# EAGLE design boba_fett_chest (EAGLE 7.0.0)
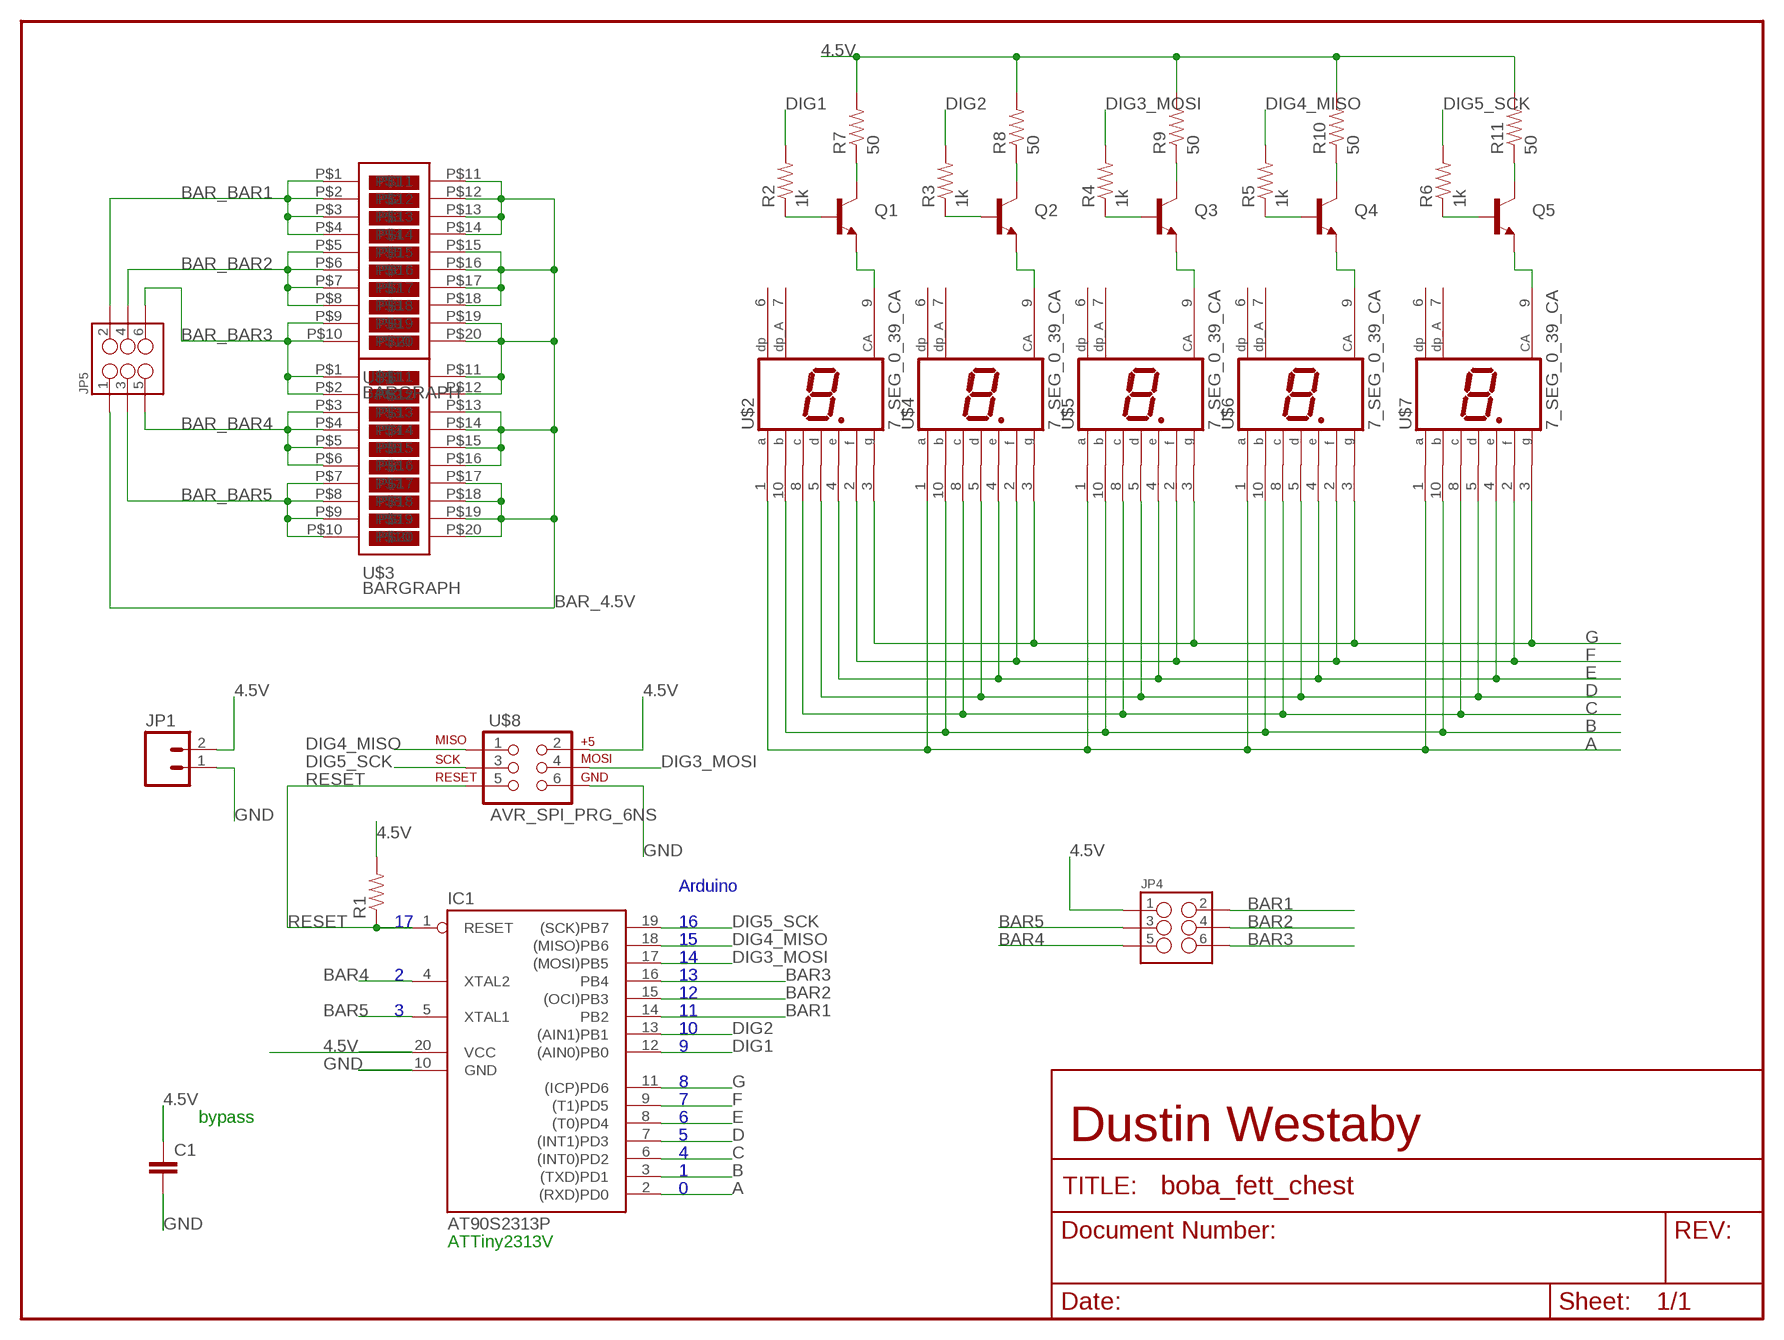
[diagram p0: schematic, sheet 1]

## Parts
C1  CAPCAP-PTH-2MM  [CAP-PTH-2MM]
IC1  AT90S2313P  [DIL20]
JP1  M02PTH  [1X02]
JP4  M03X22X3_SILK_SM  [2X3]
JP5  M03X22X3_SILK_SM  [2X3]
Q1  TRANSISTOR_NPNTO92  [TO-92]
Q2  TRANSISTOR_NPNTO92  [TO-92]
Q3  TRANSISTOR_NPNTO92  [TO-92]
Q4  TRANSISTOR_NPNTO92  [TO-92]
Q5  TRANSISTOR_NPNTO92  [TO-92]
R1  RESISTORPTH1  [AXIAL-0.3]
R2  1k  RESISTORPTH1  [AXIAL-0.3]
R3  1k  RESISTORPTH1  [AXIAL-0.3]
R4  1k  RESISTORPTH1  [AXIAL-0.3]
R5  1k  RESISTORPTH1  [AXIAL-0.3]
R6  1k  RESISTORPTH1  [AXIAL-0.3]
R7  50  RESISTORPTH1  [AXIAL-0.3]
R8  50  RESISTORPTH1  [AXIAL-0.3]
R9  50  RESISTORPTH1  [AXIAL-0.3]
R10  50  RESISTORPTH1  [AXIAL-0.3]
R11  50  RESISTORPTH1  [AXIAL-0.3]
U$1  BARGRAPH  [BARGRAPH]
U$2  7_SEG_0_39_CA  [0_39_DISP]
U$3  BARGRAPH  [BARGRAPH]
U$4  7_SEG_0_39_CA  [0_39_DISP]
U$5  7_SEG_0_39_CA  [0_39_DISP]
U$6  7_SEG_0_39_CA  [0_39_DISP]
U$7  7_SEG_0_39_CA  [0_39_DISP]
U$8  AVR_SPI_PRG_6NS  [2X3-NS]

## Nets
4.5V: C1.1 IC1.20(VCC) JP1.2 JP4.1 R1.P$2 R7.P$2 R8.P$2 R9.P$2 R10.P$2 R11.P$2 U$8.2
A: IC1.2((RXD)PD0) U$2.1(A) U$4.1(A) U$5.1(A) U$6.1(A) U$7.1(A)
B: IC1.3((TXD)PD1) U$2.10(B) U$4.10(B) U$5.10(B) U$6.10(B) U$7.10(B)
BAR1: IC1.14(PB2) JP4.2
BAR2: IC1.15((OCI)PB3) JP4.4
BAR3: IC1.16(PB4) JP4.6
BAR4: IC1.4(XTAL2) JP4.5
BAR5: IC1.5(XTAL1) JP4.3
BAR_4.5V: JP5.1 U$1.P$11 U$1.P$12 U$1.P$13 U$1.P$14 U$1.P$15 U$1.P$16 U$1.P$17 U$1.P$18 U$1.P$19 U$1.P$20 U$3.P$11 U$3.P$12 U$3.P$13 U$3.P$14 U$3.P$15 U$3.P$16 U$3.P$17 U$3.P$18 U$3.P$19 U$3.P$20
BAR_BAR1: JP5.2 U$1.P$1 U$1.P$2 U$1.P$3 U$1.P$4
BAR_BAR2: JP5.4 U$1.P$5 U$1.P$6 U$1.P$7 U$1.P$8
BAR_BAR3: JP5.6 U$1.P$9 U$1.P$10 U$3.P$1 U$3.P$2
BAR_BAR4: JP5.5 U$3.P$3 U$3.P$4 U$3.P$5 U$3.P$6
BAR_BAR5: JP5.3 U$3.P$7 U$3.P$8 U$3.P$9 U$3.P$10
C: IC1.6((INT0)PD2) U$2.8(C) U$4.8(C) U$5.8(C) U$6.8(C) U$7.8(C)
D: IC1.7((INT1)PD3) U$2.5(D) U$4.5(D) U$5.5(D) U$6.5(D) U$7.5(D)
DIG1: IC1.12((AIN0)PB0) R2.P$2
DIG2: IC1.13((AIN1)PB1) R3.P$2
DIG3_MOSI: IC1.17((MOSI)PB5) R4.P$2 U$8.4
DIG4_MISO: IC1.18((MISO)PB6) R5.P$2 U$8.1
DIG5_SCK: IC1.19((SCK)PB7) R6.P$2 U$8.3
E: IC1.8((T0)PD4) U$2.4(E) U$4.4(E) U$5.4(E) U$6.4(E) U$7.4(E)
F: IC1.9((T1)PD5) U$2.2(F) U$4.2(F) U$5.2(F) U$6.2(F) U$7.2(F)
G: IC1.11((ICP)PD6) U$2.3(G) U$4.3(G) U$5.3(G) U$6.3(G) U$7.3(G)
GND: C1.2 IC1.10(GND) JP1.1 U$8.6
N$1: Q5.1(E) U$7.9(CA)
N$2: Q4.1(E) U$6.9(CA)
N$3: Q3.1(E) U$5.9(CA)
N$4: Q2.1(E) U$4.9(CA)
N$5: Q1.1(E) U$2.9(CA)
N$6: Q1.2(B) R2.P$1
N$7: Q2.2(B) R3.P$1
N$8: Q3.2(B) R4.P$1
N$9: Q4.2(B) R5.P$1
N$10: Q5.2(B) R6.P$1
N$16: Q1.3(C) R7.P$1
N$17: Q2.3(C) R8.P$1
N$18: Q3.3(C) R9.P$1
N$19: Q4.3(C) R10.P$1
N$20: Q5.3(C) R11.P$1
RESET: IC1.1(RESET) R1.P$1 U$8.5
Unconnected: U$2.6(DP) U$2.7(CA) U$4.6(DP) U$4.7(CA) U$5.6(DP) U$5.7(CA) U$6.6(DP) U$6.7(CA) U$7.6(DP) U$7.7(CA)

## Notes on the sheet
- Arduino
- 17 | 16
- 15
- 14
- 2 | 13
- 12
- 3 | 11
- 10
- 9
- 8
- 7
- bypass | 6
- 5 | Dustin Westaby
- 4
- 1
- 0
- ATTiny2313V

## Library data of the parts
C1 = SparkFun:CAP: Capacitor Standard 0603 ceramic capacitor, and 0.1" leaded capacitor.
IC1 = avr-5:AT90S2313: MICROCONTROLLER 2 Kbytes FLASH 128 bytes SRAM 128 bytes EEPROM UART
JP1 = SparkFun:M02: Header 2 Standard 2-pin 0.1" header. Use with straight break away headers (SKU : PRT-00116), right angle break away headers (PRT-00553), swiss pins (PRT-00743), machine pins (PRT-00117), and female headers (PRT-00115). Molex polarized connector foot print use with SKU : PRT-08233 with associated crimp pins and housings.
JP4 JP5 = SparkFun-Connectors:M03X2: 2x3 .1" header. Shrouded, with keying- CONN-10681 SMT- CONN-11415 Pogo pins- HW-11044
Q1-Q5 = SparkFun:TRANSISTOR_NPN: Transistor NPN BJT configuration in SOT23 package. MMBT2222 is the common NPN we use. Double check BCE configuration again layout.
R1-R11 = SparkFun:RESISTOR: Resistor Basic schematic elements and footprints for 0603, 1206, and PTH 1/10th watt (small) resistors.
U$1 U$3 = boba_display:BARGRAPH
U$2 U$4-U$7 = boba_display_4:7_SEG_0_39_CA
U$8 = SparkFun:AVR_SPI_PRG_6: AVR ISP 6 Pin This is the reduced ISP connector for AVR programming. Common on Arduino. This footprint will take up less PCB space and can be used with a 10-pin to 6-pin adapter such as SKU: BOB-08508

## Board
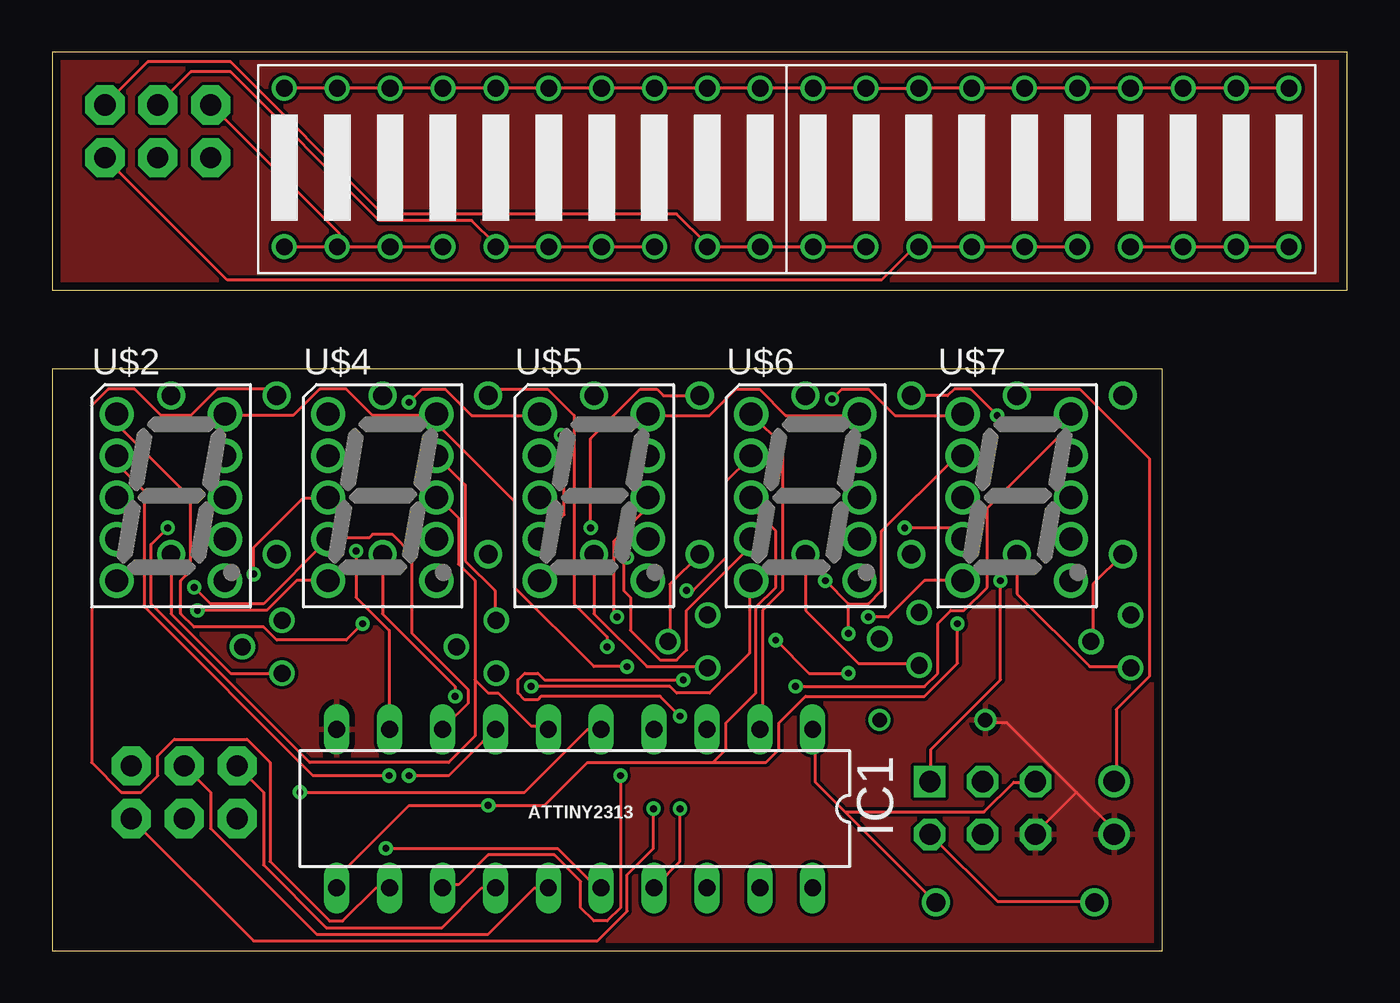
[diagram p1: board, top side]
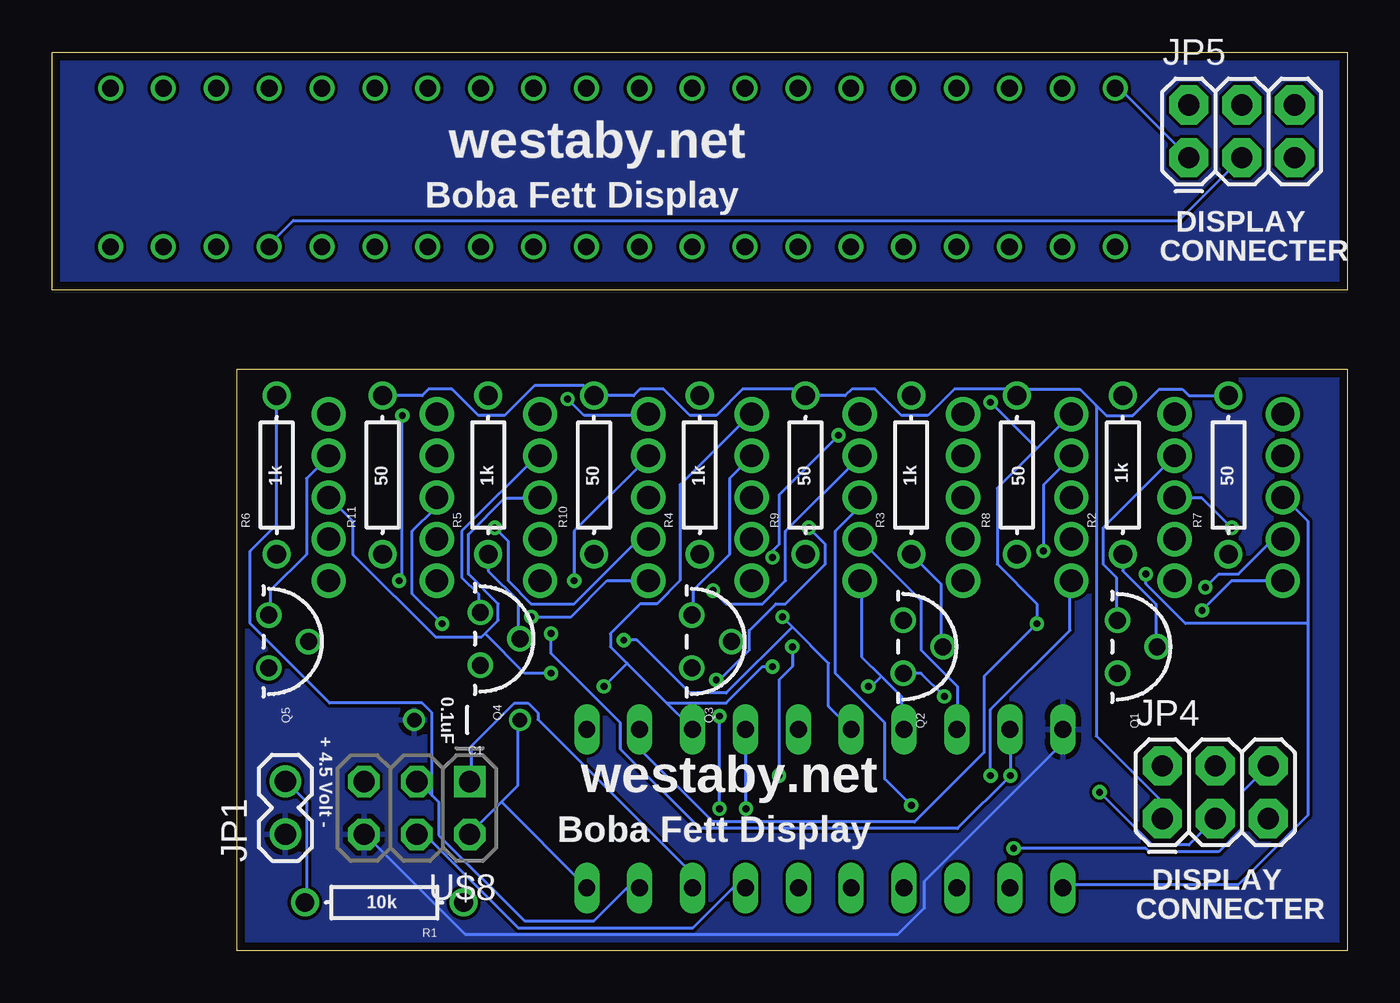
[diagram p2: board, bottom side, seen from below]

Size 62.23 x 43.18 mm. Coordinates in mm from the lower left corner, seen from the top.
Outline: 0,0 53.34,0 53.34,27.94 0,27.94 0,0
Outline: 0,31.75 62.23,31.75 62.23,43.18 0,43.18 0,31.75
Copper layers (1*16): Top 0.0356mm / dielectric 1.5011mm / Bottom 0.0356mm
Design rules "OSHpark-2layer": minimum track width 6mil, minimum drill 13mil, track to track 6mil, track to pad 6mil, pad to pad 6mil, via to via 6mil, smd to smd 6mil, copper to edge 15mil, drill to drill 6mil, minimum pad ring 7mil, minimum via ring 7mil, stop-mask expansion 3mil, vias tented up to drill 0mil, thermal gap 10mil

### Footprints (pad centres in the part's own frame; a part is rotated, then mirrored left to right if it is on the bottom)
CAP-PTH-2MM = drill 0.7: 1 -2.54,0; 2 2.54,0
DIL20 = drill 0.813 long: 1 -11.43,-3.81; 2 -8.89,-3.81; 3 -6.35,-3.81; 4 -3.81,-3.81; 5 -1.27,-3.81; 6 1.27,-3.81; 7 3.81,-3.81; 8 6.35,-3.81; 9 8.89,-3.81; 10 11.43,-3.81; 11 11.43,3.81; 12 8.89,3.81; 13 6.35,3.81; 14 3.81,3.81; 15 1.27,3.81; 16 -1.27,3.81; 17 -3.81,3.81; 18 -6.35,3.81; 19 -8.89,3.81; 20 -11.43,3.81
1X02 = drill 1.016: 1 0,0; 2 2.54,0
2X3 = drill 1.016 pad 1.88 octagon: 1 0,0; 2 0,2.54; 3 2.54,0; 4 2.54,2.54; 5 5.08,0; 6 5.08,2.54
TO-92 = drill 0.813: 1 -1.27,0; 2 0,1.905; 3 1.27,0
AXIAL-0.3 = drill 0.9: P$1 -3.81,0; P$2 3.81,0
BARGRAPH = drill 0.8: P$1 1.27,1.27; P$2 3.81,1.27; P$3 6.35,1.27; P$4 8.89,1.27; P$5 11.43,1.27; P$6 13.97,1.27; P$7 16.51,1.27; P$8 19.05,1.27; P$9 21.59,1.27; P$10 24.13,1.27; P$11 1.27,8.89; P$12 3.81,8.89; P$13 6.35,8.89; P$14 8.89,8.89; P$15 11.43,8.89; P$16 13.97,8.89; P$17 16.51,8.89; P$18 19.05,8.89; P$19 21.59,8.89; P$20 24.13,8.89
0_39_DISP = drill 1.1: 1 -0.07,8; 2 -0.07,6; 3 -0.07,4; 4 -0.07,2; 5 -0.07,0; 6 5.13,0; 7 5.13,2; 8 5.13,4; 9 5.13,6; 10 5.13,8
2X3-NS = drill 1.016 square: 1 -2.54,-1.27 | drill 1.016 octagon: 2 -2.54,1.27; 3 0,-1.27; 4 0,1.27; 5 2.54,-1.27; 6 2.54,1.27

### Placement (x,y rotation side)
C1  42.29,11.08 180 bottom
IC1  25.11,6.83 180 top
JP1  51.02,5.6 90 bottom
JP4  8.89,6.35 0 bottom
JP5  7.62,38.1 0 bottom
Q1  11.05,14.61 270 bottom
Q2  21.34,14.61 270 bottom
Q3  31.5,14.86 270 bottom
Q4  41.66,14.99 270 bottom
Q5  51.82,14.86 270 bottom
R1  46.27,2.32 180 bottom
R2  10.79,22.86 90 bottom
R3  20.95,22.86 90 bottom
R4  31.11,22.86 90 bottom
R5  41.27,22.86 90 bottom
R6  51.44,22.86 90 bottom
R7  5.71,22.86 90 bottom
R8  15.88,22.86 90 bottom
R9  26.04,22.86 90 bottom
R10  36.2,22.86 90 bottom
R11  46.35,22.86 90 bottom
U$1  9.89,32.55 0 top
U$2  3.17,17.78 0 top
U$3  35.29,32.55 0 top
U$4  13.34,17.78 0 top
U$5  23.5,17.78 0 top
U$6  33.66,17.78 0 top
U$7  43.81,17.78 0 top
U$8  44.7,6.86 180 bottom

### Tracks (layer width: path | path; a pad name or v marks a point on that pad's centre or on a via)
4.5V
  Top 0.152: R1.P$2 50.01,2.38 45.4,2.38 42.23,5.56 U$8.2 | R11.P$2 46.67,26.99 49.37,26.99 52.7,23.65 52.7,13.18 51.12,11.59 51.12,8.26 JP1.2
  Bottom 0.152: R1.P$2 50.01,2.38 50.01,7.14 50.96,8.1 JP1.2 | 40.64,7.14 42.07,5.71 U$8.2 | 40.64,7.14 39.85,7.94 39.85,10.95 C1.1 | 40.64,7.14 36.67,3.17 IC1.20 | R7.P$2 7.62,26.67 7.94,26.99 9.05,26.99 10.32,25.72 11.59,25.72 12.06,26.19 | 12.06,26.19 12.86,26.99 15.56,26.99 | 15.56,26.99 18.89,26.99 20.16,25.72 21.43,25.72 22.7,26.99 23.81,26.99 24.13,26.67 R9.P$2 26.35,26.99 29.05,26.99 30.32,25.72 31.59,25.72 32.86,26.99 33.97,26.99 34.29,26.67 R10.P$2 36.67,27.15 39.05,27.15 40.48,25.72 41.75,25.72 43.02,26.99 44.13,26.99 44.45,26.67 R11.P$2 | 15.56,26.99 R8.P$2 | JP4.1 8.89,7.14 12.06,10.32 12.06,26.19
A  (via drill 0.33)
  Top 0.152: IC1.2 34.13,10.79 34.13,16.35 35.08,17.3 35.08,24.29 33.66,25.72 U$6.1 | v37.47,26.51 37.94,26.99 39.21,26.99 40.48,25.72 43.66,25.72 U$7.1 | v14.92,15.72 14.13,14.92 10.79,14.92 10.16,15.56 6.83,15.56 6.19,16.19 6.19,17.78 6.67,18.26 6.67,21.75 3.17,25.24 3.17,25.72 U$2.1 | v17.14,26.35 17.78,26.99 18.89,26.99 20.16,25.72 23.34,25.72 U$5.1
  Bottom 0.152: v37.47,26.51 36.67,25.72 33.66,25.72 U$6.1 | 14.92,24.13 13.34,25.72 U$4.1 | 14.92,24.13 16.83,22.23 16.83,18.57 14.92,16.67 v14.92,15.72 17.46,13.18 17.46,9.53 20.8,6.19 30.48,6.19 33.97,9.68 33.97,10.64 IC1.2 | 14.92,24.13 v17.14,26.35
B  (via drill 0.33)
  Top 0.152: U$2.10 8.41,25.72 11.59,25.72 12.86,26.99 14.13,26.99 15.4,25.72 18.41,25.72 U$4.10 18.57,25.72 18.57,25.24 22.23,21.59 22.23,17.46 26.04,13.65 v27.62,13.65 | U$6.10 38.73,25.72 35.24,25.72 33.97,26.99 32.86,26.99 31.59,25.72 28.73,25.72 U$5.10 | v35.72,12.7 41.91,12.7 42.55,13.34 42.55,15.72 43.18,16.35 43.81,16.35 44.93,17.46 44.93,21.27 48.9,25.24 48.9,25.72 U$7.10
  Bottom 0.152: 34.61,13.81 35.4,14.61 35.4,15.24 33.97,16.67 33.18,16.67 32.07,17.78 32.07,22.38 28.73,25.72 U$5.10 | 34.61,13.81 32.7,11.91 | 32.7,11.91 31.59,10.79 IC1.3 | 34.61,13.81 v35.72,12.7 | v27.62,13.65 28.1,13.65 29.84,11.91 32.7,11.91
BAR1
  Top 0.152: JP4.2 10.16,7.62 10.16,4.13 13.18,1.11 18.73,1.11 20.64,3.02 21.27,3.02 IC1.14
BAR2
  Top 0.152: JP4.4 7.62,7.62 7.62,5.87 12.7,0.79 20.95,0.79 23.18,3.02 23.81,3.02 IC1.15
BAR3  (via drill 0.33)
  Top 0.152: v16.03,4.92 24.29,4.92 26.04,3.17 26.35,3.17 IC1.16
  Bottom 0.152: v16.03,4.92 9.68,4.92 9.53,4.76 6.19,4.76 5.08,5.87 5.08,7.62 JP4.6
BAR4  (via drill 0.33)
  Top 0.152: v28.89,6.83 28.89,4.92 27.62,3.65 27.62,1.91 26.19,0.48 9.68,0.48 JP4.5
  Bottom 0.152: v28.89,6.83 28.89,10.64 IC1.4
BAR5  (via drill 0.33)
  Top 0.152: v11.91,7.62 22.7,7.62 25.72,10.64 26.35,10.64 IC1.5
  Bottom 0.152: v11.91,7.62 9.37,5.08 7.62,5.08 JP4.3
BAR_4.5V
  Top 0.152: U$3.P$20 59.37,41.43 56.99,41.43 U$3.P$19 56.83,41.43 54.45,41.43 U$3.P$18 54.29,41.43 51.91,41.43 U$3.P$17 51.75,41.43 49.37,41.43 U$3.P$16 49.21,41.43 46.83,41.43 U$3.P$15 46.67,41.43 44.29,41.43 U$3.P$14 44.13,41.43 41.75,41.43 U$3.P$13 41.59,41.43 39.21,41.43 U$3.P$12 39.05,41.43 36.67,41.43 U$3.P$11 36.51,41.43 34.13,41.43 U$1.P$20 33.97,41.43 31.59,41.43 U$1.P$19 31.43,41.43 29.05,41.43 U$1.P$18 28.89,41.43 26.51,41.43 U$1.P$17 26.35,41.43 23.97,41.43 U$1.P$16 23.81,41.43 21.43,41.43 U$1.P$15 21.27,41.43 18.89,41.43 U$1.P$14 18.73,41.43 16.35,41.43 U$1.P$13 16.19,41.43 13.81,41.43 U$1.P$12 13.65,41.43 11.27,41.43 U$1.P$11
  Bottom 0.152: JP5.1 11.11,41.59 U$1.P$11
BAR_BAR1
  Top 0.152: U$1.P$1 11.27,33.81 13.65,33.81 U$1.P$2 | U$1.P$4 18.73,33.81 16.35,33.81 U$1.P$3 16.19,33.81 13.81,33.81 U$1.P$2 | JP5.2 13.81,34.45 13.81,33.97 U$1.P$2
BAR_BAR2
  Top 0.152: U$1.P$8 28.89,33.81 26.51,33.81 U$1.P$7 26.35,33.81 23.97,33.81 U$1.P$6 23.81,33.81 21.43,33.81 U$1.P$5 21.27,33.97 20.16,35.08 15.72,35.08 8.57,42.23 6.67,42.23 JP5.4
BAR_BAR3
  Top 0.152: U$3.P$2 39.05,33.81 36.67,33.81 U$3.P$1 36.51,33.81 34.13,33.81 U$1.P$10 33.97,33.81 31.59,33.81 U$1.P$9 31.43,33.97 30,35.4 15.88,35.4 8.57,42.7 4.6,42.7 JP5.6
BAR_BAR4
  Top 0.152: U$3.P$6 49.21,33.81 46.83,33.81 U$3.P$5 46.67,33.81 44.29,33.81 U$3.P$4 44.13,33.81 41.75,33.81 U$3.P$3 41.59,33.97 39.85,32.23 8.41,32.23 JP5.5
BAR_BAR5
  Top 0.152: U$3.P$7 51.91,33.81 54.29,33.81 U$3.P$8 54.45,33.81 56.83,33.81 U$3.P$9 56.99,33.81 59.37,33.81 U$3.P$10
  Bottom 0.152: JP5.3 8.1,35.08 50.64,35.08 51.75,33.97 U$3.P$7
C  (via drill 0.33)
  Top 0.152: 20.32,13.02 20.95,12.38 21.43,12.38 23.02,10.79 23.81,10.79 IC1.6 | 20.32,13.02 20.32,17.78 19.53,18.57 19.53,20.8 18.57,21.75 U$4.8 | v5.56,20.32 4.76,19.53 4.76,16.67 12.38,9.05 19.05,9.05 20.32,10.32 20.32,13.02 | v27.15,16.03 26.99,16.19 26.99,19.68 28.57,21.27 28.57,21.75 U$5.8 | v38.26,13.34 36.35,13.34 v34.77,14.92
  Bottom 0.152: 41.43,15.24 41.59,15.08 43.81,15.08 47.78,19.05 47.78,20.64 48.9,21.75 U$7.8 | 41.43,15.24 40.8,15.88 40.8,16.67 42.23,18.1 42.23,20 40.48,21.75 38.89,21.75 U$6.8 | v5.56,20.32 6.99,21.75 8.26,21.75 U$2.8 | 26.67,15.56 24.92,13.81 24.92,11.75 23.97,10.79 IC1.6 | 26.67,15.56 v27.15,16.03 | 41.43,15.24 39.53,13.34 v38.26,13.34 | v34.77,14.92 34.13,14.92 31.59,12.38 29.84,12.38 26.67,15.56
D  (via drill 0.33)
  Top 0.152: v6.99,16.35 10.32,16.35 11.75,17.78 U$4.5 | v39.21,16.03 40.16,16.03 41.91,17.78 U$7.5 | v23.02,12.7 29.69,12.7 30,12.38 31.59,12.38 33.5,14.29 33.5,17.78 U$6.5 | v17.14,8.41 19.05,8.41 21.27,10.64 IC1.7
  Bottom 0.152: U$2.5 5.56,17.78 v6.99,16.35 | 22.38,13.18 23.34,14.13 23.34,17.78 U$5.5 | 22.38,13.18 21.43,12.22 21.43,10.79 IC1.7 | U$6.5 35.56,17.78 37.31,16.03 v39.21,16.03 | 22.38,13.18 22.86,12.7 v23.02,12.7 | v17.14,8.41 17.14,11.59 13.34,15.4 13.34,17.78 U$4.5
DIG1
  Top 0.152: R2.P$2 10.48,26.99 7.94,26.99 6.67,25.72 5.24,25.72 3.97,26.99 2.7,26.99 1.91,26.19 1.91,9.05 3.33,7.62 4.29,7.62 5.08,8.41 5.08,9.37 5.87,10.16 9.37,10.16 10.48,9.05 10.48,4.29 13.34,1.43 13.97,1.43 15.56,3.02 16.19,3.02 IC1.12
DIG2  (via drill 0.33)
  Top 0.152: v27.3,8.41 27.3,2.06 26.67,1.43 26.04,1.43 25.4,2.06 25.4,3.33 24.13,4.6 20.95,4.6 19.53,3.17 18.89,3.17 IC1.13 | v26.67,14.61 26.67,15.08 25.08,16.67 25.08,25.72 23.81,26.99 21.27,26.99 R3.P$2
  Bottom 0.152: v27.3,8.41 27.3,13.02 26.67,13.65 v26.67,14.61
DIG3_MOSI  (via drill 0.33)
  Top 0.152: R4.P$2 29.37,26.67 29.05,26.99 28.26,26.99 25.88,24.61 v25.88,20.32 | v30.32,13.02 23.65,13.02 23.34,13.34 22.7,13.34 22.38,13.02 22.38,12.38 22.7,12.06 23.34,12.06 23.5,12.22 29.21,12.22 v30.16,11.27 | v30.16,6.83 30.16,4.29 29.05,3.17 IC1.17
  Bottom 0.152: IC1.17 29.05,3.02 29.53,3.02 31.43,1.11 39.85,1.11 44.29,5.56 44.61,5.56 U$8.4 | v25.88,20.32 25.08,19.53 25.08,18.57 26.99,16.67 27.46,16.67 28.73,15.4 28.73,14.45 30.16,13.02 v30.32,13.02 | v30.16,6.83 v30.16,11.27
DIG4_MISO  (via drill 0.33)
  Top 0.152: R5.P$2 43.02,26.67 43.34,26.99 44.13,26.99 v45.4,25.72 | v45.56,17.78 45.56,13.02 42.23,9.68 42.23,8.26 U$8.1
  Bottom 0.152: IC1.18 31.59,3.17 31.59,3.81 38.89,11.11 38.89,11.43 39.37,11.91 40.01,11.91 42.07,9.84 42.07,8.26 U$8.1 | v45.4,25.72 45.4,17.94 v45.56,17.78
DIG5_SCK
  Bottom 0.152: 43.97,7.46 44.61,8.1 U$8.3 | 43.97,7.46 43.66,7.14 43.66,5.56 39.53,1.43 36.2,1.43 34.61,3.02 34.13,3.02 IC1.19 | R6.P$2 51.44,20.48 52.7,19.21 52.7,15.72 48.9,11.91 44.45,11.91 43.97,11.43 43.97,7.46
E  (via drill 0.33)
  Top 0.152: v40.96,20.32 43.18,20.32 43.66,19.84 U$7.4 | v6.83,17.46 7.62,16.67 10.16,16.67 13.18,19.68 U$4.4 13.34,19.84 15.24,19.84 15.4,20 16.35,20 17.3,19.05 17.3,15.24 20,12.54 20,11.91 18.89,10.79 IC1.8 | v27.62,18.89 27.46,18.73 27.46,17.3 27.78,16.99 27.78,15.4 29.21,13.97 30,13.97 30.48,14.45 30.48,16.35 33.5,19.37 33.5,19.68 U$6.4 | v24.45,24.77 24.45,24.29 24.61,24.13 24.61,20.95 23.5,19.84 U$5.4
  Bottom 0.152: v40.96,20.32 40.32,19.68 40.32,17.78 39.21,16.67 37.15,16.67 34.13,19.68 33.66,19.68 U$6.4 | v6.83,17.46 6.19,18.1 5.24,18.1 3.65,19.68 3.17,19.68 U$2.4 | IC1.8 18.73,10.79 18.73,12.7 20.48,14.45 20.48,16.83 23.34,19.68 U$5.4 | v27.62,18.89 27.62,19.21 27.3,19.53 27.3,21.91 v24.45,24.77
F  (via drill 0.33)
  Top 0.152: v30.48,17.3 30.8,17.3 32.38,18.89 32.38,22.54 33.5,23.65 U$6.2 | 38.26,16.67 39.21,16.67 39.85,17.3 39.85,20.16 43.34,23.65 43.66,23.65 U$7.2 | v37.15,17.78 38.26,16.67 | v14.61,19.21 14.61,16.99 16.19,15.4 16.19,10.79 IC1.9 | v16.19,8.41 12.54,8.41 4.45,16.51 4.45,22.07 3.17,23.34 3.17,23.65 U$2.2 | v38.26,15.24 38.26,16.67
  Bottom 0.152: v30.48,17.3 29.84,16.67 28.1,16.67 26.99,17.78 26.99,20.16 23.5,23.65 U$5.2 | v37.15,17.78 37.15,20.16 33.66,23.65 U$6.2 | v14.61,19.21 14.61,22.38 13.34,23.65 U$4.2 | IC1.9 16.19,10.64 v16.19,8.41 18.73,5.87 31.11,5.87 34.92,9.68 34.92,10.95 38.26,14.29 v38.26,15.24
G  (via drill 0.33)
  Top 0.152: v9.68,18.1 9.68,19.37 12.06,21.75 13.18,21.75 U$4.3 | IC1.11 13.81,3.17 13.81,3.65 17.14,6.99 v20.95,6.99 23.65,6.99 25.72,9.05 31.75,9.05 | 31.75,9.05 32.38,9.68 32.38,10.95 33.81,12.38 33.81,16.51 34.77,17.46 34.77,20.16 33.66,21.27 33.66,21.75 U$6.3 | v43.5,15.72 43.5,13.81 41.91,12.22 36.2,12.22 34.92,10.95 34.92,9.68 34.29,9.05 31.75,9.05
  Bottom 0.152: 1.91,15.72 1.91,20.64 3.02,21.75 U$2.3 | 1.91,15.72 1.91,6.51 5.24,3.17 13.65,3.17 IC1.11 | v9.68,18.1 9.68,17.62 7.78,15.72 1.91,15.72 | v20.95,6.99 22.23,8.26 22.23,10.95 24.61,13.34 24.61,20.16 23.5,21.27 23.5,21.75 U$5.3 | v43.5,15.72 44.93,17.14 44.93,20.16 43.81,21.27 43.81,21.75 U$7.3
GND
  Top 0.152: 49.21,7.62 51.12,5.71 JP1.1 | 49.21,7.62 45.88,10.95 44.93,10.95 C1.2 | 49.21,7.62 47.31,5.71 U$8.6
  Bottom 0.152: IC1.10 13.81,10.64 13.81,9.84 20.32,3.33 20.32,2.06 21.59,0.79 42.39,0.79 47.15,5.56 U$8.6
  pour Top: 0,27.94 0,0 53.34,0 53.34,27.94
  pour Bottom: 0,27.94 0,0 53.34,0 53.34,27.94
GND1
  pour Top: 0,43.18 0,31.75 62.23,31.75 62.23,43.18
  pour Bottom: 0,43.18 0,31.75 62.23,31.75 62.23,43.18
N$1
  Bottom 0.152: Q5.1 51.75,16.19 51.75,17.3 50.01,19.05 50.01,22.7 49.05,23.65 U$7.9
N$2
  Bottom 0.152: Q4.1 41.75,16.35 41.75,17.14 42.55,17.94 42.55,20.16 38.89,23.81 U$6.9
N$3
  Bottom 0.152: Q3.1 31.43,16.19 31.43,17.3 29.69,19.05 29.69,22.7 28.73,23.65 U$5.9
N$4
  Top 0.152: Q2.1 21.27,15.88 21.27,17.3 19.84,18.73 19.84,22.38 18.57,23.65 U$4.9
N$5
  Bottom 0.152: Q1.1 11.11,15.88 11.11,17.94 11.75,18.57 11.75,20.32 8.41,23.65 U$2.9
N$6
  Bottom 0.152: R2.P$1 10.79,18.26 9.21,16.67 9.21,14.61 Q1.2
N$7
  Bottom 0.152: R3.P$1 19.53,17.62 19.53,14.61 Q2.2
N$8
  Top 0.152: R4.P$1 29.69,17.62 29.69,14.92 Q3.2
N$9
  Bottom 0.152: R5.P$1 41.27,18.26 39.85,16.83 39.85,15.08 Q4.2
N$10
  Top 0.152: R6.P$1 50.01,17.62 50.01,14.92 Q5.2
N$16
  Top 0.152: Q1.3 8.57,13.34 5.71,16.19 R7.P$1
N$17  (via drill 0.33)
  Top 0.152: v19.37,12.22 19.37,12.7 15.88,16.19 R8.P$1
  Bottom 0.152: Q2.3 20.48,13.34 v19.37,12.22
N$18
  Top 0.152: R9.P$1 26.04,16.19 28.57,13.65 31.43,13.65 Q3.3
N$19
  Top 0.152: R10.P$1 36.2,16.35 38.73,13.81 41.59,13.81 Q4.3
N$20
  Top 0.152: R11.P$1 46.35,17.14 49.85,13.65 51.75,13.65 Q5.3
RESET
  Top 0.152: 38.1,6.67 42.39,2.38 R1.P$1 | 38.1,6.67 36.67,8.1 36.67,10.64 IC1.1 | 38.1,6.67 44.77,6.67 46.2,8.1 47.15,8.1 U$8.5

### Text on the board
tPlace: ATTINY2313
bPlace: westaby.net | Boba Fett Display | DISPLAY | CONNECTER | 50 | 1k | 50 | 1k | 50 | 1k | 50 | 1k | 50 | 1k | 0.1uF | + 4.5 Volt - | westaby.net | Boba Fett Display | DISPLAY | CONNECTER | 10k
bStop: 03_15